# Altium schematic sheet driver.SchDoc
size A4
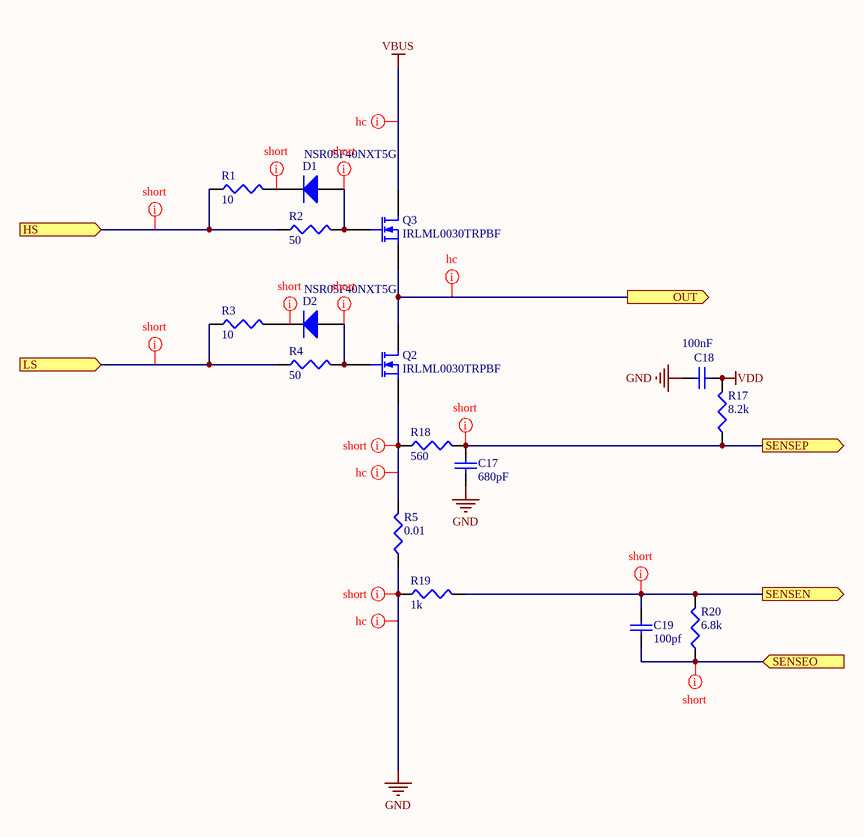
[diagram p0: driver.SchDoc]

## Parts
C17  680pF  [MY_0402]
C18  100nF  [MY_0402]
C19  100pf  [MY_0402]
D1  NSR05F40NXT5G  [MY_0402]
D2  NSR05F40NXT5G  [MY_0402]
Q2  IRLML0030TRPBF  [Micro3]
Q3  IRLML0030TRPBF  [Micro3]
R1  10  [MY_0402]
R2  50  [MY_0402]
R3  10  [MY_0402]
R4  50  [MY_0402]
R5  0.01  [MY_0603]
R17  8.2k  [MY_0402]
R18  560  [MY_0402]
R19  1k  [MY_0402]
R20  6.8k  [MY_0402]

## Ports
HS (in), LS (in), OUT (out), SENSEN (out), SENSEO (in), SENSEP (out)

## Nets
GND: C17.2 C18.1 R5.1 R19.1
VBUS: Q3.D
VDD: C18.2 R17.2
HS: R1.1 R2.1 ; port HS
LS: R3.1 R4.1 ; port LS
OUT: Q2.D Q3.S ; port OUT
SENSEN: C19.1 R19.2 R20.2 ; port SENSEN
SENSEO: C19.2 R20.1 ; port SENSEO
SENSEP: C17.1 R17.1 R18.2 ; port SENSEP
NetD1_1: D1.1(A) Q3.G R2.2
NetD1_2: D1.2(K) R1.2
NetD2_1: D2.1(A) Q2.G R4.2
NetD2_2: D2.2(K) R3.2
NetQ2_S: Q2.S R5.2 R18.1

## Layout directives
net class short: (no net found under the mark), GND, HS, LS, NetD1_1, NetD1_2, NetD2_1, NetQ2_S, SENSEN, SENSEO, SENSEP
net class hc: GND, NetQ2_S, OUT, VBUS

## Library data of the parts
C17-C19 = Cap: Capacitor; Value: 10nF; Published: 8-Jun-2000; LatestRevisionDate: 17-Jul-2002; LatestRevisionNote: Re-released for DXP Platform.; PackageReference: RAD-0.3; Publisher: Altium Limited; PackageDescription: Radial Cap, Thru-Hole; 2 Leads; 0.3 in Pin Spacing
D1 D2 = Diode: Default Diode; Published: 8-Jun-2000; LatestRevisionDate: 17-Jul-2002; LatestRevisionNote: Re-released for DXP Platform.; PackageVersion: Sep-1996; PackageReference: SMC; Publisher: Altium Limited; PackageDescription: DO-214-AB/SMC; 2 C-Bend Leads; Body 7.9 x 5.9 mm, inc. leads (LxW); Code_JEDEC: DO-214-AB
Q2 Q3 = MOSFET-N: N-Channel MOSFET; Published: 8-Jun-2000; LatestRevisionDate: 17-Jul-2002; LatestRevisionNote: Re-released for DXP Platform.; PackageVersion: 1995/1996; PackageReference: E3; Publisher: Altium Limited; PackageDescription: TO, Flat Index; 3 In-Line, Axial Leads; Body Dia. 4.6mm; Lead Dia. 0.5 mm (max)
R1-R4 R19 = Res3: Resistor; Published: 8-Jun-2000; LatestRevisionDate: 29-May-2009; LatestRevisionNote: IPC-7351 Footprint Added.; PackageReference: J1-0603; Publisher: Altium Limited; PackageDescription: Chip Resistor
  R1 R3: Value: 10
  R2 R4: Value: 50
  R19: Value: 1K
R5 R17 R18 R20 = Res3: Resistor; Value: 1K; Published: 8-Jun-2000; LatestRevisionDate: 29-May-2009; LatestRevisionNote: IPC-7351 Footprint Added.; PackageReference: J1-0603; Publisher: Altium Limited; PackageDescription: Chip Resistor